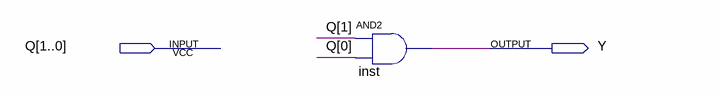
[diagram p0: schematic sheet]
// Quartus schematic OUTPUT_LOGIC.bdf as structural Verilog: 1 symbols, 2 pins
module OUTPUT_LOGIC (
  input  [1:0] Q,
  output Y
);

  and inst (Y, Q[1], Q[0]);
endmodule
